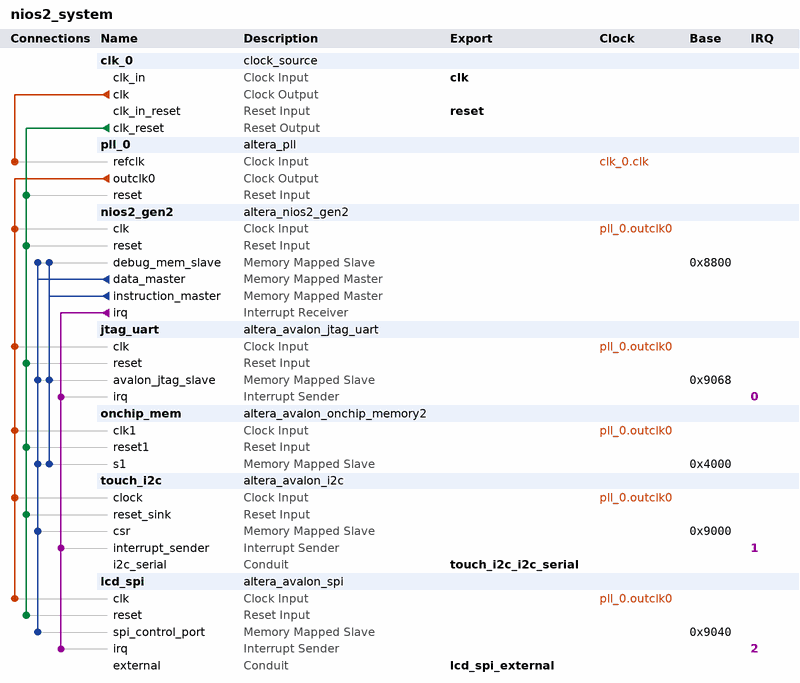
[diagram p0: system contents]
# Platform Designer (Qsys) system nios2_system, Cyclone V 5CSEBA6U23I7
# Parameters at their usual value, and those the tool derives, are not listed.
package require -exact qsys 18.1
create_system nios2_system
set_project_property DEVICE_FAMILY {Cyclone V}
set_project_property DEVICE 5CSEBA6U23I7

add_instance clk_0 clock_source 18.1
set_instance_parameter_value clk_0 clockFrequency 50000000

add_instance pll_0 altera_pll 18.1
set_instance_parameter_value pll_0 gui_device_speed_grade 1
set_instance_parameter_value pll_0 gui_number_of_clocks 1
set_instance_parameter_value pll_0 gui_operation_mode direct
set_instance_parameter_value pll_0 gui_output_clock_frequency0 100.0
set_instance_parameter_value pll_0 gui_pll_mode {Integer-N PLL}
set_instance_parameter_value pll_0 gui_reference_clock_frequency 50.0
set_instance_parameter_value pll_0 gui_use_locked false

add_instance nios2_gen2 altera_nios2_gen2 18.1
set_instance_parameter_value nios2_gen2 dcache_size 2048
set_instance_parameter_value nios2_gen2 exceptionSlave onchip_mem.s1
set_instance_parameter_value nios2_gen2 icache_size 4096
set_instance_parameter_value nios2_gen2 impl Tiny
set_instance_parameter_value nios2_gen2 resetSlave onchip_mem.s1

add_instance jtag_uart altera_avalon_jtag_uart 18.1
set_instance_parameter_value jtag_uart simInteractiveOptions NO_INTERACTIVE_WINDOWS

add_instance onchip_mem altera_avalon_onchip_memory2 18.1
set_instance_parameter_value onchip_mem dataWidth 32
set_instance_parameter_value onchip_mem dualPort false
set_instance_parameter_value onchip_mem initMemContent true
set_instance_parameter_value onchip_mem initializationFileName onchip_mem.hex
set_instance_parameter_value onchip_mem memorySize 10240

add_instance touch_i2c altera_avalon_i2c 18.1
set_instance_parameter_value touch_i2c FIFO_DEPTH 4

add_instance lcd_spi altera_avalon_spi 18.1
set_instance_parameter_value lcd_spi clockPolarity 0
set_instance_parameter_value lcd_spi dataWidth 9
set_instance_parameter_value lcd_spi masterSPI true
set_instance_parameter_value lcd_spi numberOfSlaves 1
set_instance_parameter_value lcd_spi targetClockRate 25000000

# connections
add_connection clk_0.clk pll_0.refclk clock
add_connection pll_0.outclk0 jtag_uart.clk clock
add_connection pll_0.outclk0 lcd_spi.clk clock
add_connection pll_0.outclk0 nios2_gen2.clk clock
add_connection pll_0.outclk0 onchip_mem.clk1 clock
add_connection pll_0.outclk0 touch_i2c.clock clock
add_connection clk_0.clk_reset jtag_uart.reset reset
add_connection clk_0.clk_reset lcd_spi.reset reset
add_connection clk_0.clk_reset nios2_gen2.reset reset
add_connection clk_0.clk_reset onchip_mem.reset1 reset
add_connection clk_0.clk_reset pll_0.reset reset
add_connection clk_0.clk_reset touch_i2c.reset_sink reset
add_connection nios2_gen2.data_master jtag_uart.avalon_jtag_slave avalon
set_connection_parameter_value nios2_gen2.data_master/jtag_uart.avalon_jtag_slave baseAddress 0x9068
add_connection nios2_gen2.data_master lcd_spi.spi_control_port avalon
set_connection_parameter_value nios2_gen2.data_master/lcd_spi.spi_control_port baseAddress 0x9040
add_connection nios2_gen2.data_master nios2_gen2.debug_mem_slave avalon
set_connection_parameter_value nios2_gen2.data_master/nios2_gen2.debug_mem_slave baseAddress 0x8800
add_connection nios2_gen2.data_master onchip_mem.s1 avalon
set_connection_parameter_value nios2_gen2.data_master/onchip_mem.s1 baseAddress 0x4000
add_connection nios2_gen2.data_master touch_i2c.csr avalon
set_connection_parameter_value nios2_gen2.data_master/touch_i2c.csr baseAddress 0x9000
add_connection nios2_gen2.instruction_master jtag_uart.avalon_jtag_slave avalon
set_connection_parameter_value nios2_gen2.instruction_master/jtag_uart.avalon_jtag_slave baseAddress 0x9068
add_connection nios2_gen2.instruction_master nios2_gen2.debug_mem_slave avalon
set_connection_parameter_value nios2_gen2.instruction_master/nios2_gen2.debug_mem_slave baseAddress 0x8800
add_connection nios2_gen2.instruction_master onchip_mem.s1 avalon
set_connection_parameter_value nios2_gen2.instruction_master/onchip_mem.s1 baseAddress 0x4000
add_connection nios2_gen2.irq jtag_uart.irq interrupt
set_connection_parameter_value nios2_gen2.irq/jtag_uart.irq irqNumber 0
add_connection nios2_gen2.irq lcd_spi.irq interrupt
set_connection_parameter_value nios2_gen2.irq/lcd_spi.irq irqNumber 2
add_connection nios2_gen2.irq touch_i2c.interrupt_sender interrupt
set_connection_parameter_value nios2_gen2.irq/touch_i2c.interrupt_sender irqNumber 1

# exported interfaces
add_interface clk clock sink
set_interface_property clk EXPORT_OF clk_0.clk_in
add_interface lcd_spi_external conduit end
set_interface_property lcd_spi_external EXPORT_OF lcd_spi.external
add_interface reset reset sink
set_interface_property reset EXPORT_OF clk_0.clk_in_reset
add_interface touch_i2c_i2c_serial conduit end
set_interface_property touch_i2c_i2c_serial EXPORT_OF touch_i2c.i2c_serial

set_interconnect_requirement {$system} qsys_mm.clockCrossingAdapter HANDSHAKE
set_interconnect_requirement {$system} qsys_mm.enableEccProtection FALSE
set_interconnect_requirement {$system} qsys_mm.insertDefaultSlave FALSE
set_interconnect_requirement {$system} qsys_mm.maxAdditionalLatency 1

save_system nios2_system.qsys
